# EAGLE design MS5849 (EAGLE 9.7.0)
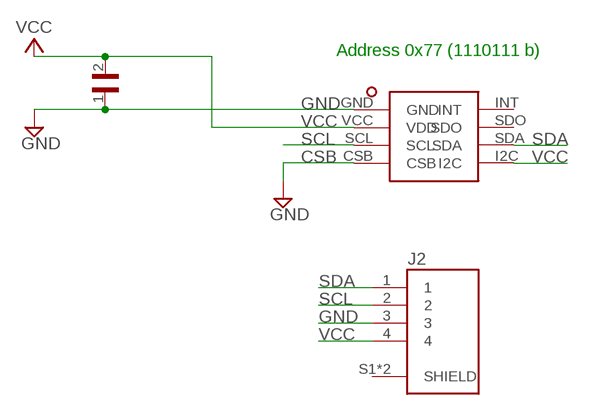
[diagram p0: schematic, sheet 1]

## Parts
C2  CC0603KRX7R9BB104  [CAPC1608X90]
J2  B4B-ZR-SM4-TFT(LF)(SN)  [JST_B4B-ZR-SM4-TFT(LF)(SN)]
U$2  MS5849-30B  [MS5849-30B-FOOTPRINT]

## Nets
CSB: U$2.CSB ; supply symbol labelled GND
GND: C2.1 J2.3 U$2.GND
SCL: J2.2 U$2.SCL
SDA: J2.1 U$2.SDA
VCC: C2.2 J2.4 U$2.I2C U$2.VCC(VDD)
Unconnected: J2.S1(SHIELD) J2.S2(SHIELD) U$2.INT U$2.SDO

## Notes on the sheet
- Address 0x77 (1110111 b)

## Library data of the parts
C2 = CC0603KRX7R9BB104:CC0603KRX7R9BB104: CAPACITOR, 0603, 100NF, 50V, X7R; Dielectric Characteristic:X7R; Capacitance:100000pF; Capacitance Tolerance:± 10%; Voltage Rating:50V; Temperature Coefficient:± 15%; Capacitor Case Style:0603; No. of Pins:2; Mounting Type:SMD; Operating Temperature Range:-55°C to +125°C; SVHC:No SVHC; Application:Standard; Capacitor Dielectric Type:Multilayer Ceramic; Case Style:0603; Max Operating Temperature:125°C; Min Temperature Operating:-55°C; Terminal Type:Surface Mount (SMD, SMT); Termination Type:SMD; Tolerance, +:10%; Tolerance, -:10%; Voltage Rating DC:50V
J2 = B4B-ZR-SM4-TFT:B4B-ZR-SM4-TFT(LF)(SN): ZH Series 4 Position 1.5 mm Pitch Top Entry Surface Mount Shrouded Header; MANUFACTURER: JST; PARTREV: N/A; STANDARD: Manufacturer Recommendations
U$2 = MS5849-30B:MS5849-30B

## Board
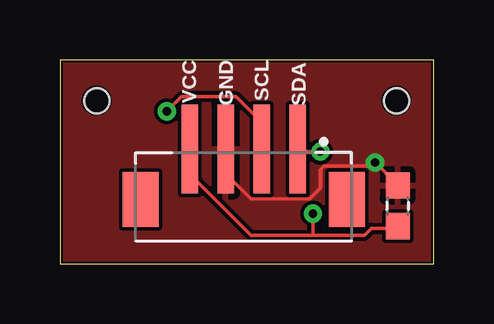
[diagram p1: board, top side]
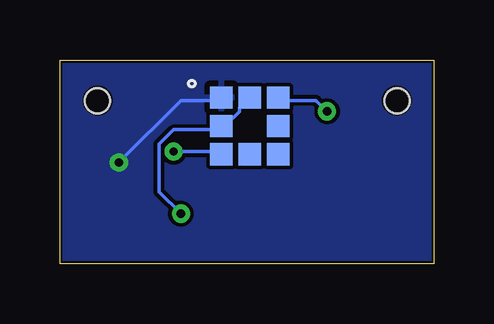
[diagram p2: board, bottom side, seen from below]

Size 15.6 x 8.5 mm. Coordinates in mm from the lower left corner, seen from the top.
Outline: 0,0 15.6,0 15.6,8.5 0,8.5 0,0
Copper layers (1*16): Top 0.035mm / dielectric 1.5mm / Bottom 0.035mm
Design rules "Fusion Electronics Design Rules": minimum track width 6mil, minimum drill 0.35mm, track to track 6mil, track to pad 6mil, pad to pad 6mil, via to via 6mil, smd to smd 6mil, copper to edge 0.1mm, drill to drill 6mil, minimum pad ring 10mil, minimum via ring 8mil, stop-mask expansion 4mil, vias tented up to drill 0mil, thermal gap 10mil
Holes 1.05 mm at 14.03,6.8 1.54,6.8

### Footprints (pad centres in the part's own frame; a part is rotated, then mirrored left to right if it is on the bottom)
CAPC1608X90 = smd 1.1 x 1: 1 -0.85,0; 2 0.85,0
JST_B4B-ZR-SM4-TFT(LF)(SN) = smd 0.7 x 3.7: 1 -2.25,-2; 2 -0.75,-2; 3 0.75,-2; 4 2.25,-2 | smd 1.5 x 2.3: S1 4.3,0.1; S2 -4.3,0.1
MS5849-30B-FOOTPRINT = smd 0.93 x 0.93: CSB -8.295,2.37; GND -10.665,3.555; I2C -10.665,2.37; INT -8.295,1.185; SCL -8.295,3.555; SDA -10.665,1.185; SDO -9.48,1.185; VCC -9.48,3.555

### Placement (x,y rotation side)
C2  14.08,2.41 270 top
J2  7.67,2.78 180 top
U$2  -1.8,3.37 0 bottom

### Tracks (layer width: path | path; a pad name or v marks a point on that pad's centre or on a via)
GND  (via drill 0.35)
  Top 0.152: 13.3,4.07 14.06,3.3 C2.1 | 13.3,4.07 11.01,4.07 10.86,3.91 10.86,3.15 10.4,2.69 7.96,2.69 7.05,3.61 7.05,4.68 J2.3 | 13.3,4.07 v13.14,4.22
  Bottom 0.152: v13.14,4.22 10.55,6.81 8.88,6.81 U$2.GND
  pour Top: -0.27,-0.08 15.89,-0.08 15.89,8.74 -0.27,8.74
  pour Bottom: -0.55,-0.46 16.11,-0.46 16.11,8.96 -0.55,8.96
SCL  (via drill 0.35)
  Top 0.152: v4.46,6.35 5.07,6.96 7.35,6.96 8.27,6.05 8.27,4.83 J2.2
  Bottom 0.152: v4.46,6.35 4.92,6.81 6.44,6.81 U$2.SCL
SDA  (via drill 0.35)
  Top 0.152: v10.86,4.68 9.94,4.68 J2.1
  Bottom 0.152: v10.86,4.68 8.88,4.68 U$2.SDA
VCC  (via drill 0.35)
  Top 0.152: 10.55,1.17 7.96,1.17 5.53,3.61 5.53,4.68 J2.4 | 10.55,1.17 12.69,1.17 12.99,1.48 14.06,1.48 C2.2 | 10.55,1.17 v10.55,2.09
  Bottom 0.152: U$2.VCC 7.81,6.81 8.12,6.5 8.12,6.35 8.72,5.74 U$2.I2C 8.88,5.59 10.86,5.59 11.47,4.98 11.47,3 v10.55,2.09

### Text on the board
tPlace: VCC | GND | SCL | SDA